# EAGLE design TSL2561_v0.1 (EAGLE 9.6.2)
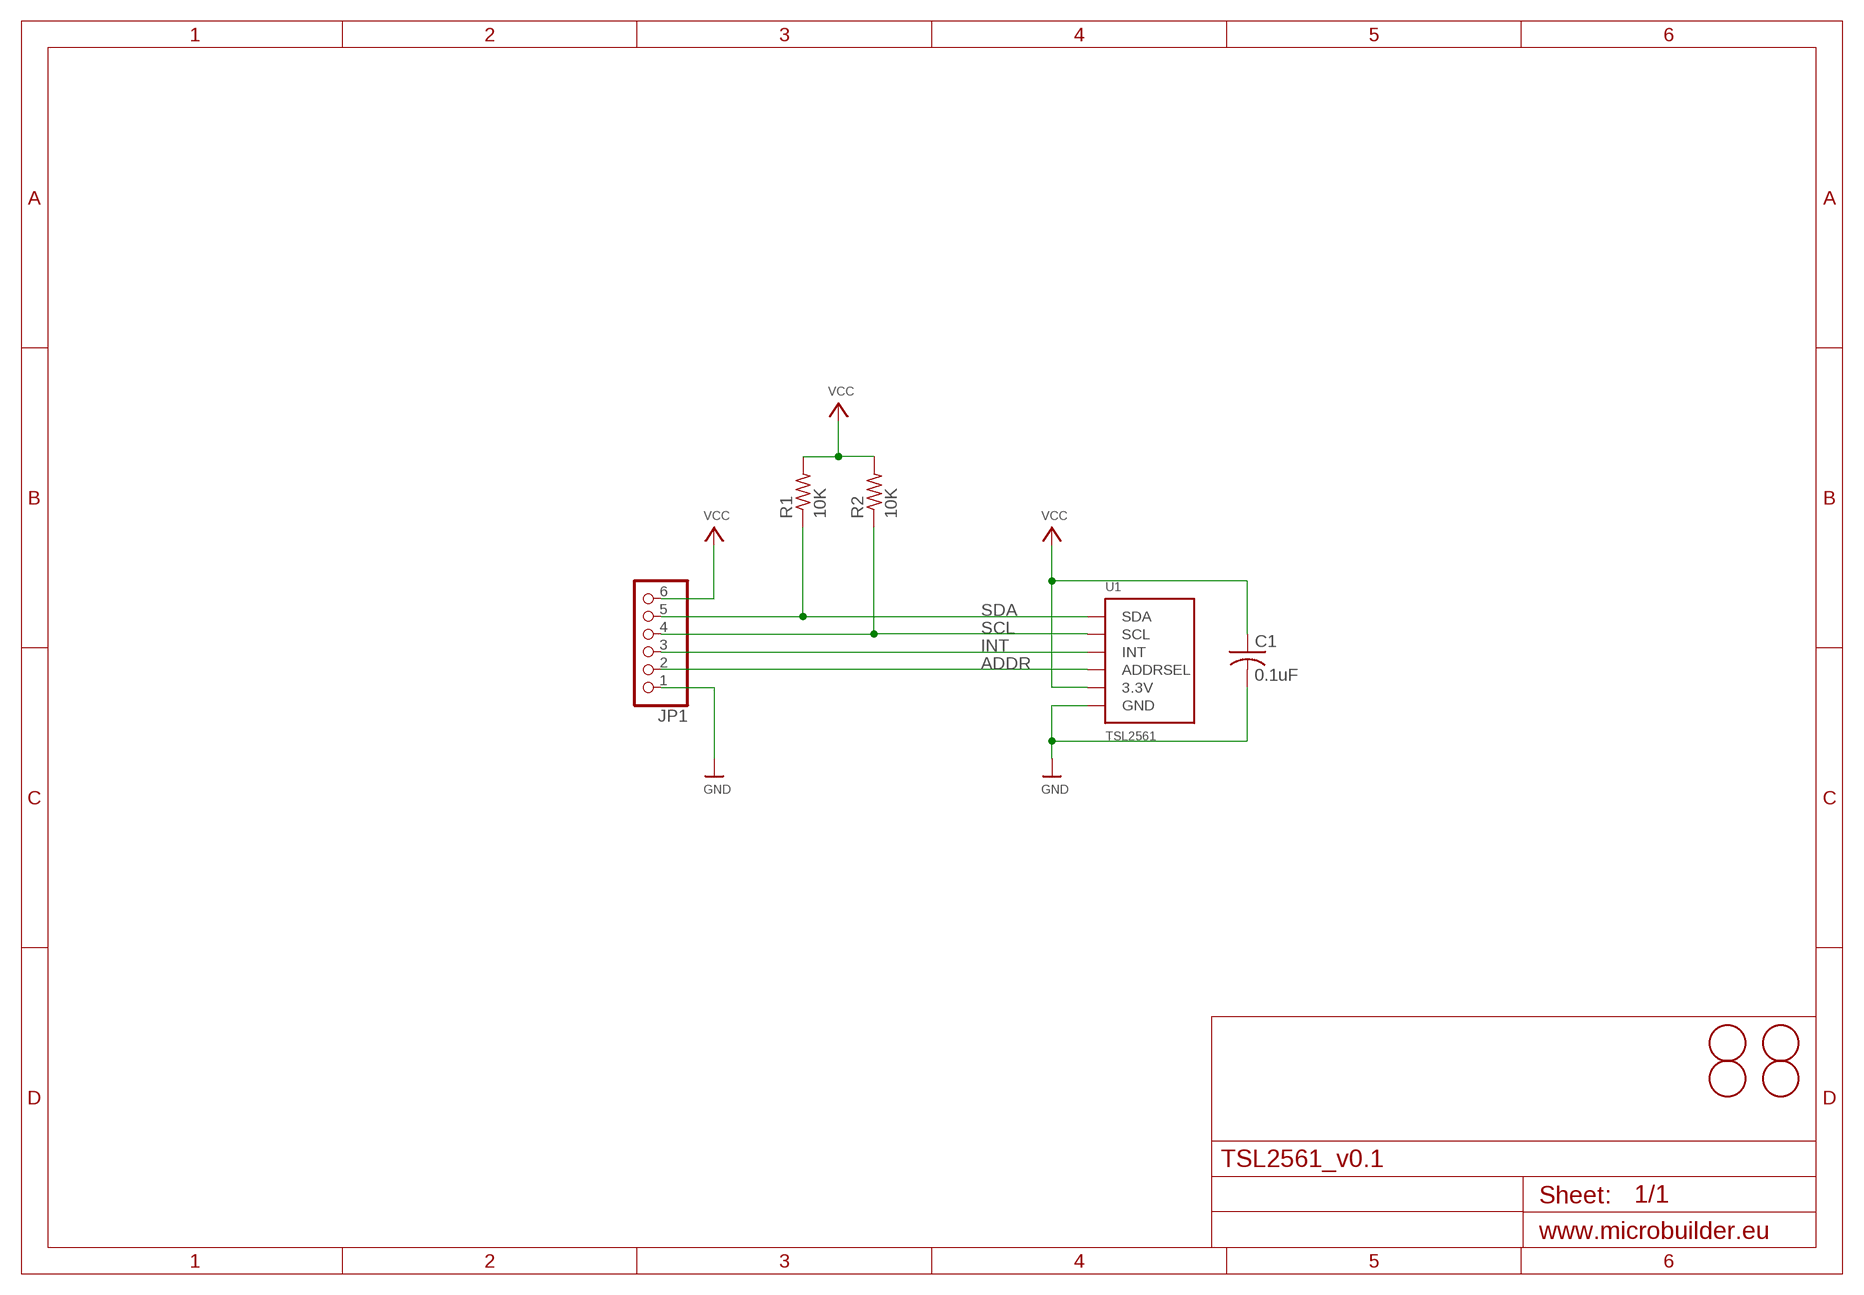
[diagram p0: schematic, sheet 1]

## Parts
C1  0.1uF  C-USC0805  [C0805]
JP1  HEADER-1X676MIL  [1X06_ROUND_76]
R1  10K  R-US_R0805  [R0805]
R2  10K  R-US_R0805  [R0805]
U1  TSL2561  [TSL2561_FN]
U$2  FIDUCIAL  [FIDUCIAL_1MM]
U$4  FIDUCIAL  [FIDUCIAL_1MM]
U$5  MOUNTINGHOLE2.0  [MOUNTINGHOLE_2.0_PLATED]
U$6  MOUNTINGHOLE2.0  [MOUNTINGHOLE_2.0_PLATED]

## Nets
ADDR: JP1.2 U1.ADR(ADDRSEL)
GND: C1.2 JP1.1 U1.VSS(GND)
INT: JP1.3 U1.INT
SCL: JP1.4 R2.1 U1.CLK(SCL)
SDA: JP1.5 R1.1 U1.DATA(SDA)
VCC: C1.1 JP1.6 R1.2 R2.2 U1.VDD(3.3V)

## Library data of the parts
C1 = adafruit:C-US: CAPACITOR, American symbol
JP1 = microbuilder:HEADER-1X6: PIN HEADER
R1 R2 = adafruit:R-US_: RESISTOR, American symbol
U1 = microbuilder:TSL2561: TSL2561 Light-To-Digital Sensor Mouser Part Numbers: CS (obsolete): 856-TSL2561CS DFN (cheapest): 856-TSL2561FN
U$2 U$4 = adafruit:FIDUCIAL: For use by pick and place machines to calibrate the vision/machine, 1mm By microbuilder.eu
U$5 U$6 = microbuilder:MOUNTINGHOLE: Mounting Hole

## Board
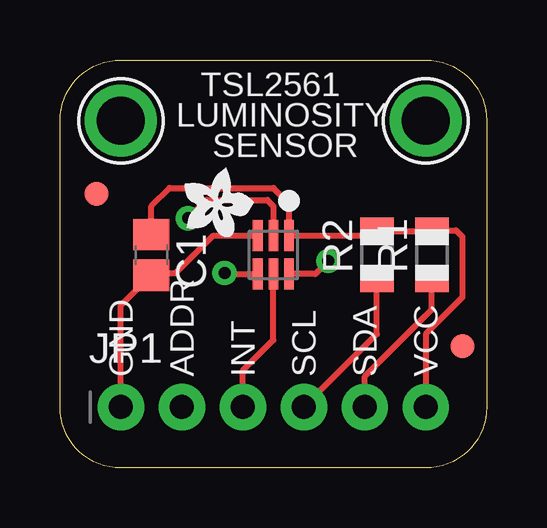
[diagram p1: board, top side]
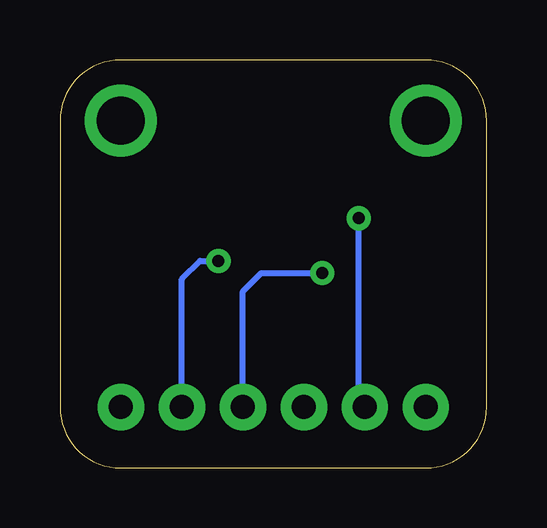
[diagram p2: board, bottom side, seen from below]

Size 17.78 x 17.02 mm. Coordinates in mm from the lower left corner, seen from the top.
Outline: 0,2.54 0,14.48 arc-90 2.54,17.02 15.24,17.02 arc-90 17.78,14.48 17.78,2.54 arc-90 15.24,0 2.54,0 arc-90 0,2.54
Copper layers (1*16): Top 0.035mm / dielectric 1.5mm / Bottom 0.035mm
Design rules "default *": minimum track width 8mil, minimum drill 0.4mm, track to track 8mil, track to pad 8mil, pad to pad 8mil, via to via 8mil, smd to smd 8mil, copper to edge 20mil, drill to drill 8mil, minimum pad ring 8mil, minimum via ring 10mil, stop-mask expansion 3mil, vias tented up to drill 20mil, thermal gap 8mil

### Footprints (pad centres in the part's own frame; a part is rotated, then mirrored left to right if it is on the bottom)
C0805 = smd 1.3 x 1.5: 1 -0.85,0; 2 0.85,0
1X06_ROUND_76 = drill 1 pad 1.93: 1 -6.35,0; 2 -3.81,0; 3 -1.27,0; 4 1.27,0; 5 3.81,0; 6 6.35,0
R0805 = smd 1.1 x 1.4: 1 -1,0; 2 1,0
TSL2561_FN = smd 1.3 x 0.4: ADR -0.8,0; CLK 0.8,-0.65; DATA 0.8,0.65; INT 0.8,0; VDD -0.8,0.65; VSS -0.8,-0.65
FIDUCIAL_1MM = smd 1 x 1: 1 0,0
MOUNTINGHOLE_2.0_PLATED = drill 2 pad 3: P$1 0,0

### Placement (x,y rotation side)
C1  3.81,8.89 270 top
JP1  8.89,2.54 0 top
R1  15.49,8.89 90 top
R2  13.21,8.89 90 top
U1  8.89,8.89 270 top
U$2  1.52,11.43 0 top
U$4  16.76,5.08 0 top
U$5  15.24,14.48 0 top
U$6  2.54,14.48 0 top
U$7  [ADAFRUIT200MIL]  6.6,11.18 270 top

### Tracks (layer width: path | path; a pad name or v marks a point on that pad's centre or on a via)
ADDR  (via drill 0.5)
  Top 0.254: U1.ADR 8.89,10.92 8.64,11.18 6.1,11.18 v5.33,10.41
  Bottom 0.254: v5.33,10.41 5.33,2.79 JP1.2
GND
  Top 0.254: JP1.1 2.54,6.77 C1.2 3.9,8.13 4.83,8.13 6.39,9.69 U1.VSS
INT
  Top 0.254: U1.INT 8.89,5.33 7.62,4.06 JP1.3
SCL  (via drill 0.5)
  Top 0.254: JP1.4 13.21,5.59 R2.1 | U1.CLK 6.9,8.09 v6.86,8.13
  Bottom 0.254: v6.86,8.13 9.4,8.13 10.16,7.37 JP1.4
SDA  (via drill 0.5)
  Top 0.254: R1.1 15.49,6.6 12.7,3.81 JP1.5 | U1.DATA 10.63,8.09 v11.18,8.64
  Bottom 0.254: v11.18,8.64 11.94,8.64 12.7,7.87 JP1.5
VCC
  Top 0.254: C1.1 3.81,10.92 4.57,11.68 8.89,11.68 9.54,11.03 U1.VDD 13.01,9.69 R2.2 R1.2 15.51,9.91 16.51,9.91 16.76,9.65 16.76,7.11 15.24,5.59 JP1.6

### Text on the board
tPlace: TSL2561 | LUMINOSITY | SENSOR | GND | ADDR | INT | SCL | SDA | VCC